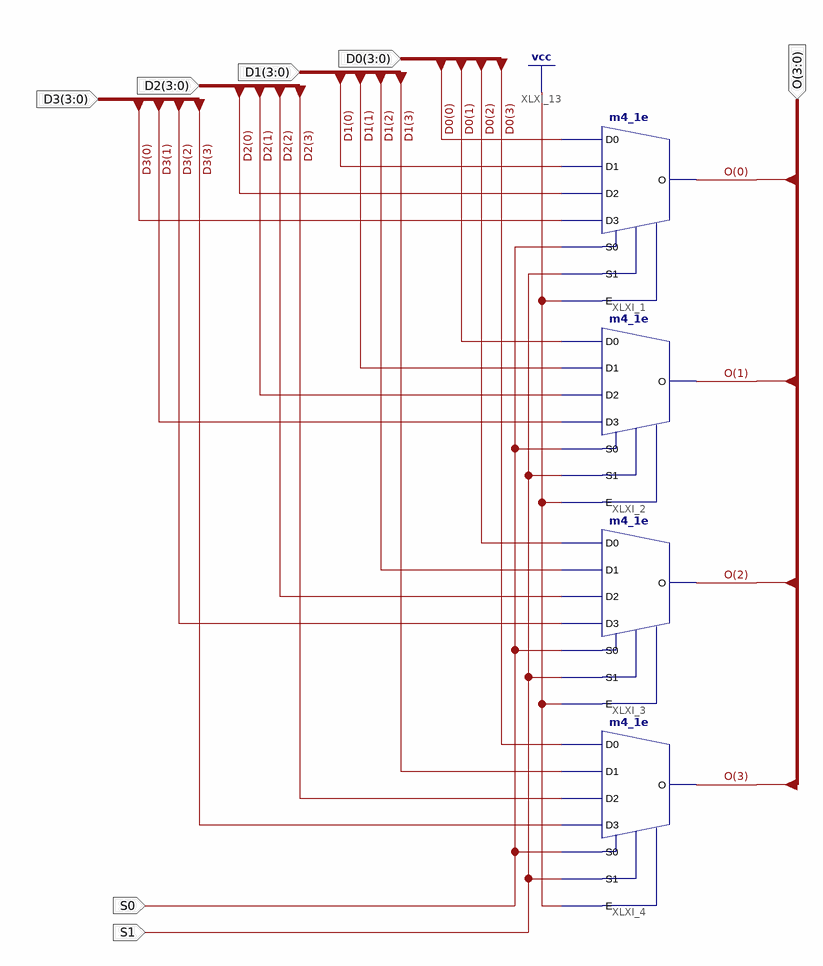
[diagram p0: schematic sheet 1]
// Xilinx ISE schematic mux4x1x4.sch (spartan6) as structural Verilog: 4 symbols, 7 ports
module mux4x1x4 (
  input  [3:0] D0,
  input  [3:0] D1,
  input  [3:0] D2,
  input  [3:0] D3,
  input  S0,
  input  S1,
  input  [3:0] O
);

  m4_1e XLXI_1 (.D0(D0[0]), .D1(D1[0]), .D2(D2[0]), .D3(D3[0]), .E(1'b1), .S0(S0), .S1(S1), .O(O[0]));
  m4_1e XLXI_2 (.D0(D0[1]), .D1(D1[1]), .D2(D2[1]), .D3(D3[1]), .E(1'b1), .S0(S0), .S1(S1), .O(O[1]));
  m4_1e XLXI_3 (.D0(D0[2]), .D1(D1[2]), .D2(D2[2]), .D3(D3[2]), .E(1'b1), .S0(S0), .S1(S1), .O(O[2]));
  m4_1e XLXI_4 (.D0(D0[3]), .D1(D1[3]), .D2(D2[3]), .D3(D3[3]), .E(1'b1), .S0(S0), .S1(S1), .O(O[3]));
endmodule
